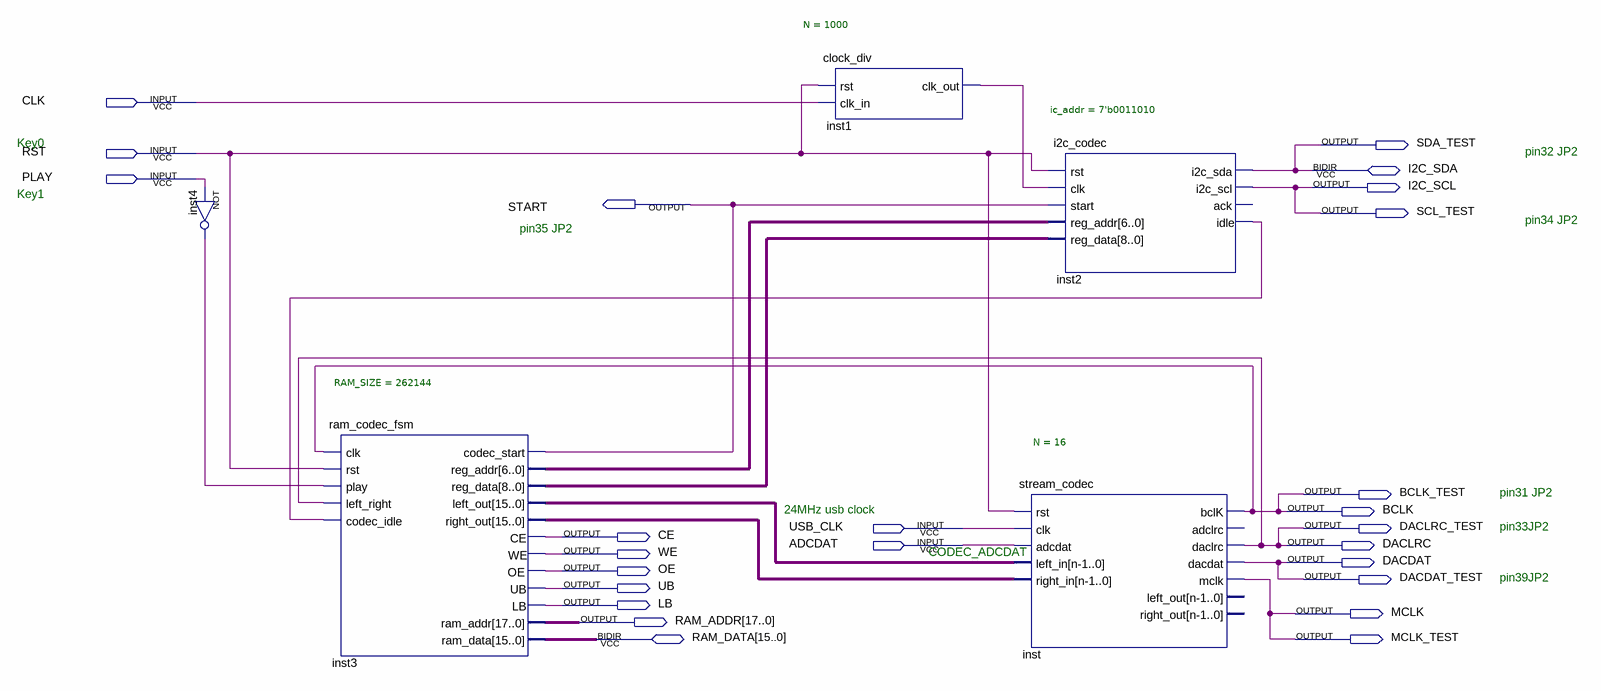
[diagram p0: schematic sheet]
// Quartus schematic top.bdf as structural Verilog: 5 symbols, 25 pins
module top (
  input  CLK,
  input  RST,
  input  PLAY,
  input  USB_CLK,
  input  ADCDAT,
  inout  I2C_SDA,
  inout  [15:0] RAM_DATA,
  output SDA_TEST,
  output I2C_SCL,
  output START,
  output SCL_TEST,
  output BCLK_TEST,
  output BCLK,
  output DACLRC_TEST,
  output CE,
  output DACLRC,
  output WE,
  output DACDAT,
  output OE,
  output DACDAT_TEST,
  output UB,
  output LB,
  output MCLK,
  output [17:0] RAM_ADDR,
  output MCLK_TEST
);

  wire inst1_clk_out, inst2_idle, inst4_out;
  wire [6:0] inst3_reg_addr;
  wire [8:0] inst3_reg_data;
  wire [15:0] inst3_left_out, inst3_right_out;

  not inst4 (inst4_out, PLAY);
  ram_codec_fsm #(.RAM_SIZE(262144)) inst3 (
    .clk(BCLK), .rst(RST), .play(inst4_out), .left_right(DACLRC), .codec_idle(inst2_idle),
    .codec_start(START), .reg_addr(inst3_reg_addr), .reg_data(inst3_reg_data), .left_out(inst3_left_out),
    .right_out(inst3_right_out), .CE(CE), .WE(WE), .OE(OE), .UB(UB), .LB(LB), .ram_addr(RAM_ADDR),
    .ram_data(RAM_DATA));
  clock_div #(.N(1000)) inst1 (.rst(RST), .clk_in(CLK), .clk_out(inst1_clk_out));
  stream_codec #(.N(16)) inst (
    .rst(RST), .clk(USB_CLK), .adcdat(ADCDAT), .left_in(inst3_left_out), .right_in(inst3_right_out),
    .bclK(BCLK), .daclrc(DACLRC), .dacdat(DACDAT), .mclk(MCLK));  // open: adclrc, left_out, right_out
  i2c_codec #(.ic_addr(7'b0011010)) inst2 (
    .rst(RST), .clk(inst1_clk_out), .start(START), .reg_addr(inst3_reg_addr), .reg_data(inst3_reg_data),
    .i2c_scl(I2C_SCL), .idle(inst2_idle), .i2c_sda(I2C_SDA));  // open: ack

  assign BCLK_TEST = BCLK;
  assign DACDAT_TEST = DACDAT;
  assign DACLRC_TEST = DACLRC;
  assign MCLK_TEST = MCLK;
  assign SCL_TEST = I2C_SCL;
  assign SDA_TEST = I2C_SDA;

  // Notes on the sheet:
  //   Key0
  //   pin32 JP2
  //   Key1
  //   pin34 JP2
  //   pin35 JP2
  //   pin31 JP2
  //   24MHz usb clock
  //   pin33JP2
  //   CODEC_ADCDAT
  //   pin39JP2
endmodule
